# EAGLE design GPIO Split Protector (EAGLE 7.4.0)
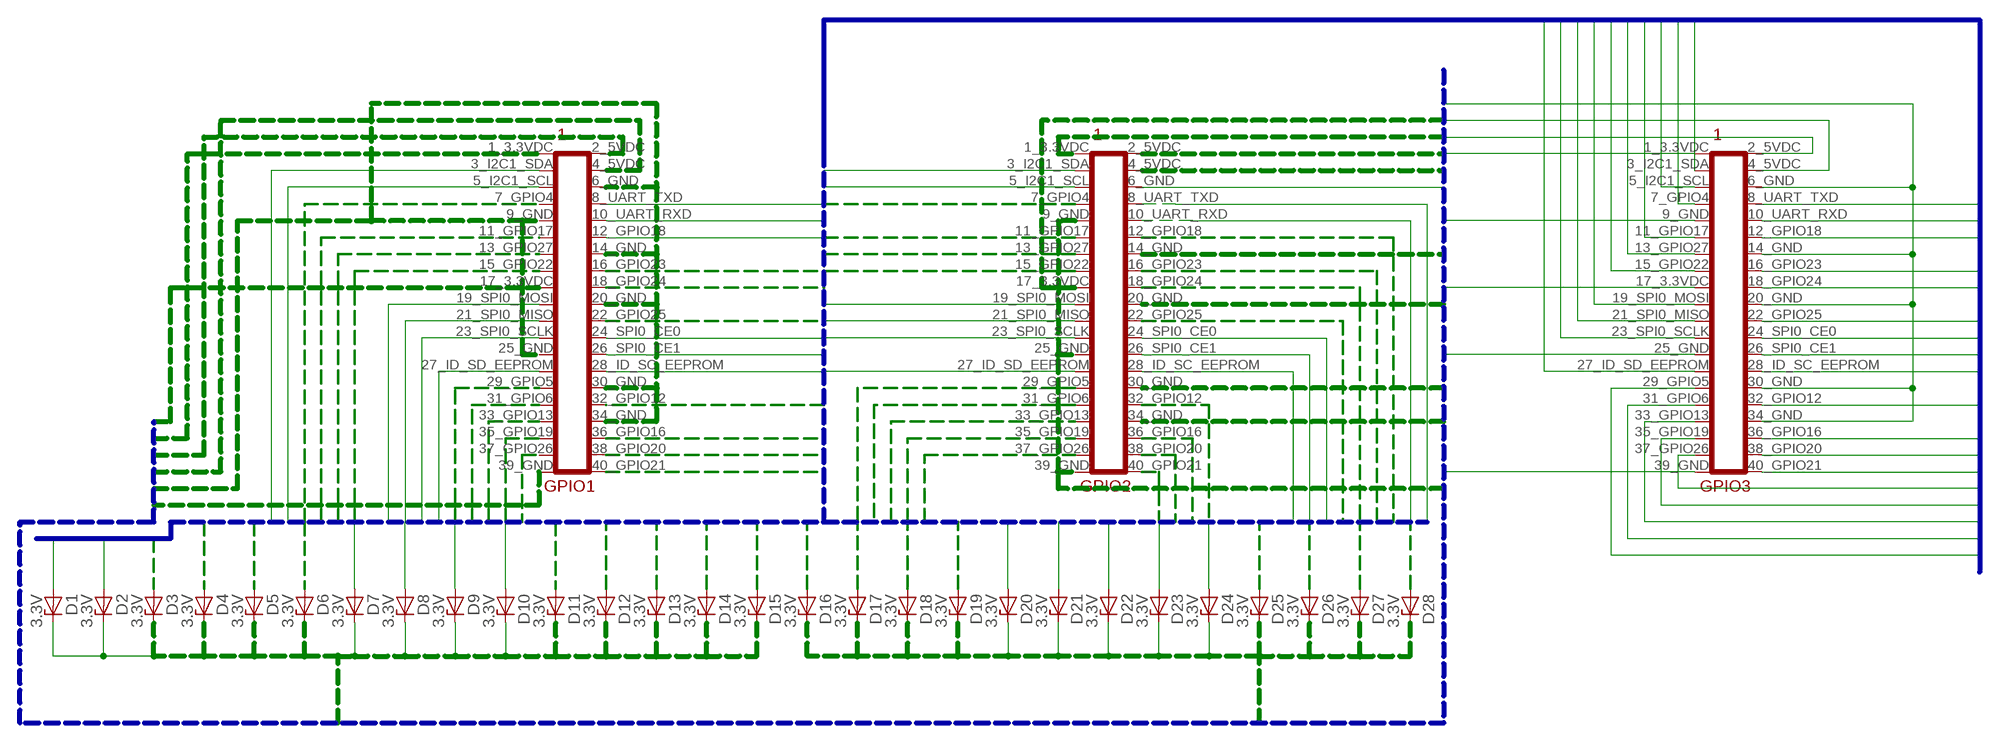
[diagram p0: schematic, sheet 1]

## Parts
D1  3.3V  ZENER-DIODEDO41Z10  [DO41Z10]
D2  3.3V  ZENER-DIODEDO41Z10  [DO41Z10]
D3  3.3V  ZENER-DIODEDO41Z10  [DO41Z10]
D4  3.3V  ZENER-DIODEDO41Z10  [DO41Z10]
D5  3.3V  ZENER-DIODEDO41Z10  [DO41Z10]
D6  3.3V  ZENER-DIODEDO41Z10  [DO41Z10]
D7  3.3V  ZENER-DIODEDO41Z10  [DO41Z10]
D8  3.3V  ZENER-DIODEDO41Z10  [DO41Z10]
D9  3.3V  ZENER-DIODEDO41Z10  [DO41Z10]
D10  3.3V  ZENER-DIODEDO41Z10  [DO41Z10]
D11  3.3V  ZENER-DIODEDO41Z10  [DO41Z10]
D12  3.3V  ZENER-DIODEDO41Z10  [DO41Z10]
D13  3.3V  ZENER-DIODEDO41Z10  [DO41Z10]
D14  3.3V  ZENER-DIODEDO41Z10  [DO41Z10]
D15  3.3V  ZENER-DIODEDO41Z10  [DO41Z10]
D16  3.3V  ZENER-DIODEDO41Z10  [DO41Z10]
D17  3.3V  ZENER-DIODEDO41Z10  [DO41Z10]
D18  3.3V  ZENER-DIODEDO41Z10  [DO41Z10]
D19  3.3V  ZENER-DIODEDO41Z10  [DO41Z10]
D20  3.3V  ZENER-DIODEDO41Z10  [DO41Z10]
D21  3.3V  ZENER-DIODEDO41Z10  [DO41Z10]
D22  3.3V  ZENER-DIODEDO41Z10  [DO41Z10]
D23  3.3V  ZENER-DIODEDO41Z10  [DO41Z10]
D24  3.3V  ZENER-DIODEDO41Z10  [DO41Z10]
D25  3.3V  ZENER-DIODEDO41Z10  [DO41Z10]
D26  3.3V  ZENER-DIODEDO41Z10  [DO41Z10]
D27  3.3V  ZENER-DIODEDO41Z10  [DO41Z10]
D28  3.3V  ZENER-DIODEDO41Z10  [DO41Z10]
GPIO1  RPI_GPIOUPPER  [RPI_GPIO_MALE]
GPIO2  RPI_GPIOUPPER  [RPI_GPIO_MALE]
GPIO3  RPI_GPIOUPPER  [RPI_GPIO_MALE]

## Nets
3.3VDC1: GPIO1.1_3.3VDC GPIO2.1_3.3VDC GPIO3.1_3.3VDC
3.3VDC2: GPIO1.17_3.3VDC GPIO2.17_3.3VDC GPIO3.17_3.3VDC
5VDC1: GPIO1.2_5VDC GPIO2.2_5VDC GPIO3.2_5VDC
5VDC2: GPIO1.4_5VDC GPIO2.4_5VDC GPIO3.4_5VDC
GND: D1.C D2.C D3.C D4.C D5.C D6.C D7.C D8.C D9.C D10.C D11.C D12.C D13.C D14.C D15.C D16.C D17.C D18.C D19.C D20.C D21.C D22.C D23.C D24.C D25.C D26.C D27.C D28.C GPIO1.6_GND GPIO1.9_GND GPIO1.14_GND GPIO1.20_GND GPIO1.25_GND GPIO1.30_GND GPIO1.34_GND GPIO1.39_GND GPIO2.6_GND GPIO2.9_GND GPIO2.14_GND GPIO2.20_GND GPIO2.25_GND GPIO2.30_GND GPIO2.34_GND GPIO2.39_GND GPIO3.6_GND GPIO3.9_GND GPIO3.14_GND GPIO3.20_GND GPIO3.25_GND GPIO3.30_GND GPIO3.34_GND GPIO3.39_GND
GPIO4: D3.A GPIO1.7_GPIO4 GPIO2.7_GPIO4 GPIO3.7_GPIO4
GPIO5: D11.A GPIO1.29_GPIO5 GPIO2.29_GPIO5 GPIO3.29_GPIO5
GPIO6: D12.A GPIO1.31_GPIO6 GPIO2.31_GPIO6 GPIO3.31_GPIO6
GPIO12: D25.A GPIO1.32_GPIO12 GPIO2.32_GPIO12 GPIO3.32_GPIO12
GPIO13: D13.A GPIO1.33_GPIO13 GPIO2.33_GPIO13 GPIO3.33_GPIO13
GPIO16: D26.A GPIO1.36_GPIO16 GPIO2.36_GPIO16 GPIO3.36_GPIO16
GPIO17: D4.A GPIO1.11_GPIO17 GPIO2.11_GPIO17 GPIO3.11_GPIO17
GPIO18: D16.A GPIO1.12_GPIO18 GPIO2.12_GPIO18 GPIO3.12_GPIO18
GPIO19: D14.A GPIO1.35_GPIO19 GPIO2.35_GPIO19 GPIO3.35_GPIO19
GPIO20: D27.A GPIO1.38_GPIO20 GPIO2.38_GPIO20 GPIO3.38_GPIO20
GPIO21: D28.A GPIO1.40_GPIO21 GPIO2.40_GPIO21 GPIO3.40_GPIO21
GPIO22: D6.A GPIO1.15_GPIO22 GPIO2.15_GPIO22 GPIO3.15_GPIO22
GPIO23: D17.A GPIO1.16_GPIO23 GPIO2.16_GPIO23 GPIO3.16_GPIO23
GPIO24: D18.A GPIO1.18_GPIO24 GPIO2.18_GPIO24 GPIO3.18_GPIO24
GPIO25: D19.A GPIO1.22_GPIO25 GPIO2.22_GPIO25 GPIO3.22_GPIO25
GPIO26: D15.A GPIO1.37_GPIO26 GPIO2.37_GPIO26 GPIO3.37_GPIO26
GPIO27: D5.A GPIO1.13_GPIO27 GPIO2.13_GPIO27 GPIO3.13_GPIO27
I2C_SCL: D2.A GPIO1.5_I2C1_SCL GPIO2.5_I2C1_SCL GPIO3.5_I2C1_SCL
I2C_SDA: D1.A GPIO1.3_I2C1_SDA GPIO2.3_I2C1_SDA GPIO3.3_I2C1_SDA
ID_SC: D24.A GPIO1.28_ID_SC_EEPROM GPIO2.28_ID_SC_EEPROM GPIO3.28_ID_SC_EEPROM
ID_SD: D10.A GPIO1.27_ID_SD_EEPROM(27_ID_SC_EEPROM) GPIO2.27_ID_SD_EEPROM(27_ID_SC_EEPROM) GPIO3.27_ID_SD_EEPROM(27_ID_SC_EEPROM)
SPI_CE0: D22.A GPIO1.24_SPI0_CE0 GPIO2.24_SPI0_CE0 GPIO3.24_SPI0_CE0
SPI_CE1: D23.A GPIO1.26_SPI0_CE1 GPIO2.26_SPI0_CE1 GPIO3.26_SPI0_CE1
SPI_MISO: D8.A GPIO1.21_SPI0_MISO GPIO2.21_SPI0_MISO GPIO3.21_SPI0_MISO
SPI_MOSI: D7.A GPIO1.19_SPI0_MOSI GPIO2.19_SPI0_MOSI GPIO3.19_SPI0_MOSI
SPI_SCLK: D9.A GPIO1.23_SPI0_SCLK GPIO2.23_SPI0_SCLK GPIO3.23_SPI0_SCLK
UART_RXD: D21.A GPIO1.10_UART_RXD(10_UART0_RXD) GPIO2.10_UART_RXD(10_UART0_RXD) GPIO3.10_UART_RXD(10_UART0_RXD)
UART_TXD: D20.A GPIO1.8_UART_TXD(8_UART0_TXD) GPIO2.8_UART_TXD(8_UART0_TXD) GPIO3.8_UART_TXD(8_UART0_TXD)

## Buses
3.3VDC1,3.3VDC2,5VDC1,5VDC2,GND
GPIO4,GPIO5,GPIO6,GPIO12,GPIO13,GPIO14,GPIO16,GPIO17,GPIO18,GPIO19,GPIO20,GPIO21,GPIO22,GPIO23,GPIO24,GPIO25,GPIO26,GPIO27,ID_SC,ID_SD,I2C_SCL,I2C_SDA,SPI_CE0,SPI_CE1,SPI_MISO,SPI_MOSI,SPI_SCLK,UART_RXD,UART_TXD

## Library data of the parts
D1-D28 = diode:ZENER-DIODE: Z-Diode
GPIO1-GPIO3 = connectors:RPI_GPIO*: GPIO Connector for Raspberry Pi.

## Board
GPIO Protect & Split Splits the GPIO connection into two connectors, while adding protection to IO circuits so they can only take 3.3VDC and no more. All extra power gets grounded. Mounting The assembly is made to mount underneat the RPi, with the single GPIO connector hanging out. Tall enough standoffs should be used to allow connection to both connectors underneath it.
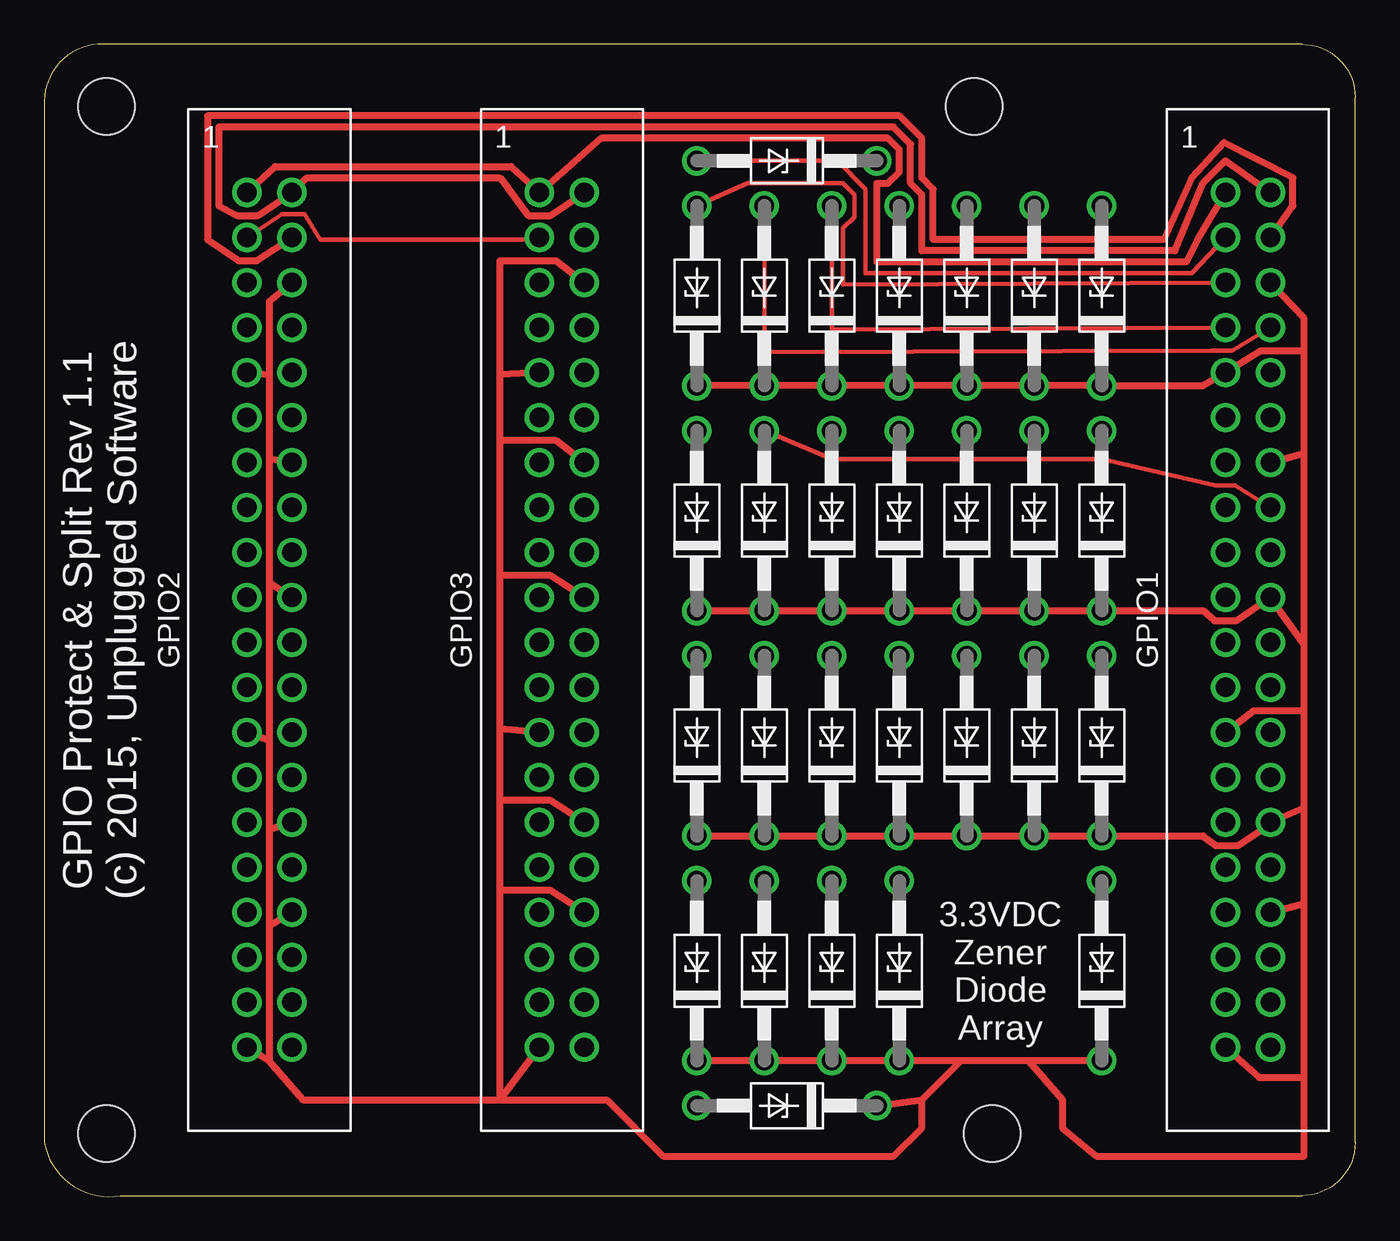
[diagram p1: board, top side]
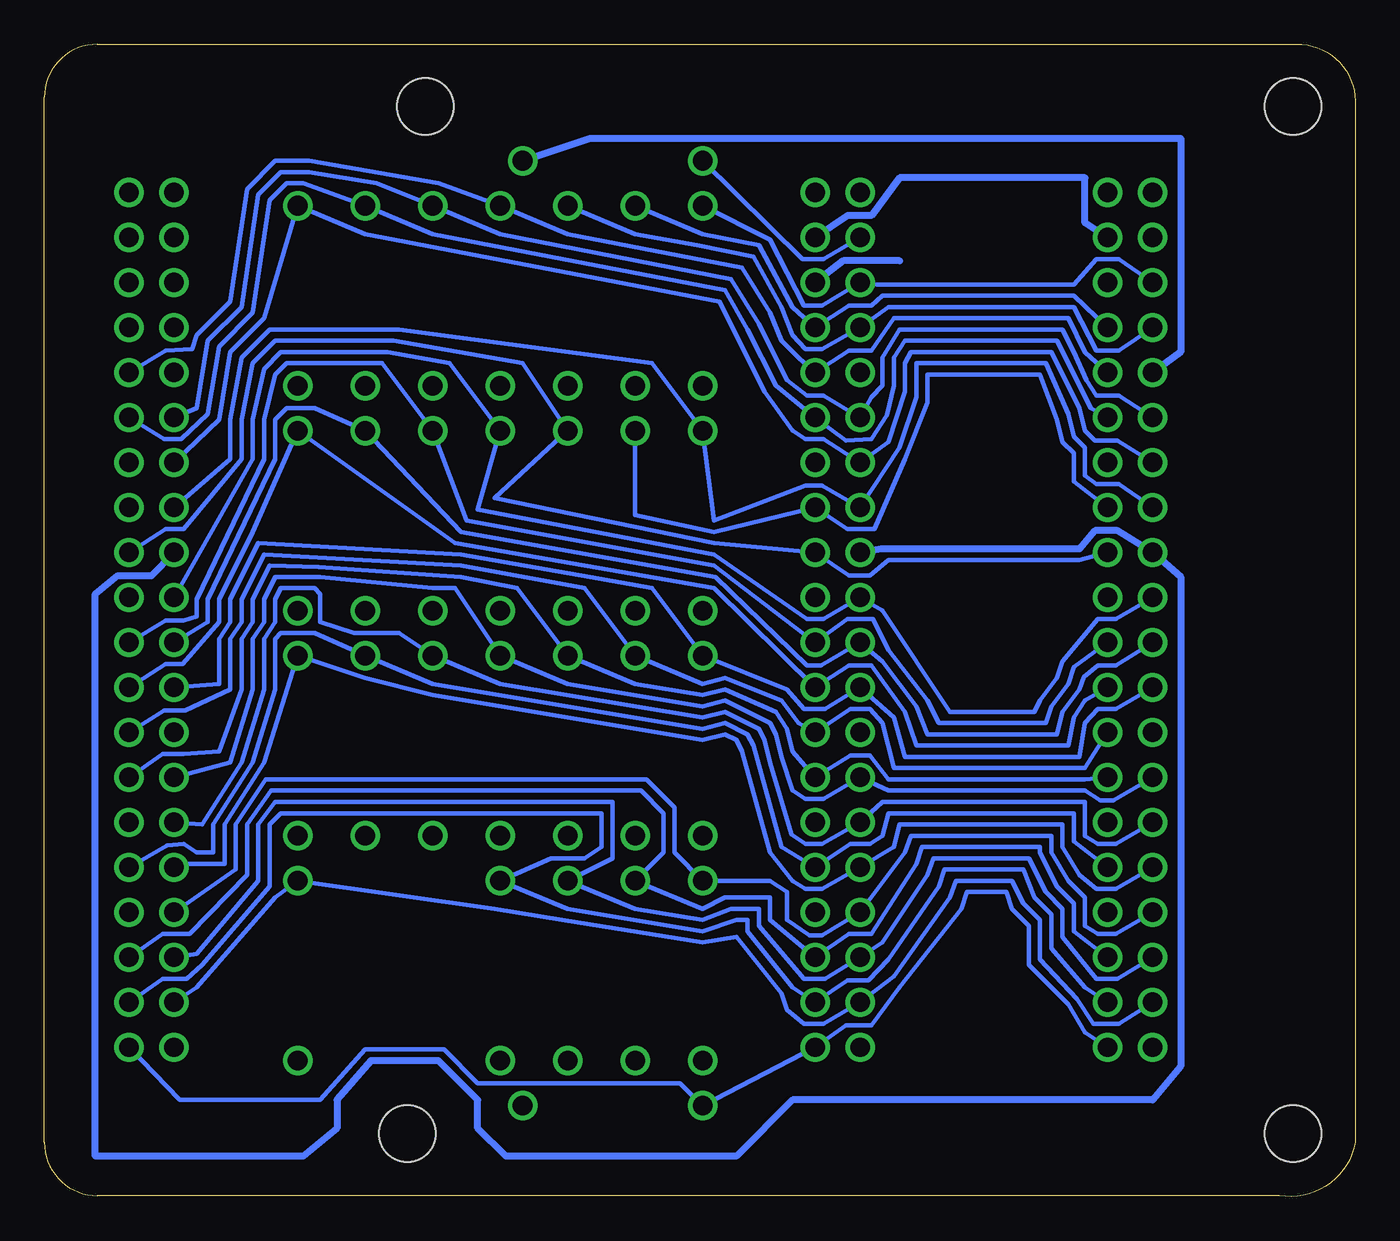
[diagram p2: board, bottom side, seen from below]

Size 74.01 x 65.05 mm. Coordinates in mm from the lower left corner, seen from the top.
Outline: 4.28,0.05 71.01,0.05 arc90 74.01,3.05 74.01,62.05 arc90 71.01,65.05 3.01,65.05 arc90 0.01,61.55 0.01,3.05 arc90 4.28,0.05
Copper layers (1*16): Top 0.035mm / dielectric 1.5mm / Bottom 0.035mm
Design rules "default *": minimum track width 10mil, minimum drill 24mil, track to track 8mil, track to pad 8mil, pad to pad 8mil, via to via 8mil, smd to smd 8mil, copper to edge 40mil, drill to drill 8mil, minimum pad ring 10mil, minimum via ring 8mil, stop-mask expansion 4mil, vias tented up to drill 0mil, thermal gap 10mil
Holes 3.2 mm at 3.51,3.55 53.51,3.55 52.51,61.55 3.51,61.55

### Footprints (pad centres in the part's own frame; a part is rotated, then mirrored left to right if it is on the bottom)
DO41Z10 = drill 1.118: A 5.08,0; C -5.08,0
RPI_GPIO_MALE = drill 1.1: 1_3.3VDC -1.27,24.13; 2_5VDC 1.27,24.13; 3_I2C1_SDA -1.27,21.59; 4_5VDC 1.27,21.59; 5_I2C1_SCL -1.27,19.05; 6_GND 1.27,19.05; 7_GPIO4 -1.27,16.51; 8_UART_TXD 1.27,16.51; 9_GND -1.27,13.97; 10_UART_RXD 1.27,13.97; 11_GPIO17 -1.27,11.43; 12_GPIO18 1.27,11.43; 13_GPIO27 -1.27,8.89; 14_GND 1.27,8.89; 15_GPIO22 -1.27,6.35; 16_GPIO23 1.27,6.35; 17_3.3VDC -1.27,3.81; 18_GPIO24 1.27,3.81; 19_SPI0_MOSI -1.27,1.27; 20_GND 1.27,1.27; 21_SPI0_MISO -1.27,-1.27; 22_GPIO25 1.27,-1.27; 23_SPI0_SCLK -1.27,-3.81; 24_SPI0_CE0 1.27,-3.81; 25_GND -1.27,-6.35; 26_SPI0_CE1 1.27,-6.35; 27_ID_SD_EEPROM -1.27,-8.89; 28_ID_SC_EEPROM 1.27,-8.89; 29_GPIO5 -1.27,-11.43; 30_GND 1.27,-11.43; 31_GPIO6 -1.27,-13.97; 32_GPIO12 1.27,-13.97; 33_GPIO13 -1.27,-16.51; 34_GND 1.27,-16.51; 35_GPIO19 -1.27,-19.05; 36_GPIO16 1.27,-19.05; 37_GPIO26 -1.27,-21.59; 38_GPIO20 1.27,-21.59; 39_GND -1.27,-24.13; 40_GPIO21 1.27,-24.13

### Placement (x,y rotation side)
D1  41.92,58.47 180 top
D2  36.84,50.85 90 top
D3  44.46,50.85 90 top
D4  52.08,50.85 90 top
D5  59.7,50.85 90 top
D6  36.84,38.15 90 top
D7  48.27,38.15 90 top
D8  55.89,38.15 90 top
D9  36.84,25.45 90 top
D10  48.27,25.45 90 top
D11  52.08,25.45 90 top
D12  59.7,25.45 90 top
D13  36.84,12.75 90 top
D14  44.46,12.75 90 top
D15  59.7,12.75 90 top
D16  55.89,50.85 90 top
D17  40.65,38.15 90 top
D18  44.46,38.15 90 top
D19  52.08,38.15 90 top
D20  40.65,50.85 90 top
D21  48.27,50.85 90 top
D22  59.7,38.15 90 top
D23  40.65,25.45 90 top
D24  44.46,25.45 90 top
D25  55.89,25.45 90 top
D26  40.65,12.75 90 top
D27  48.27,12.75 90 top
D28  41.92,5.13 180 top
GPIO1  67.95,32.55 0 top
GPIO2  12.71,32.55 0 top
GPIO3  29.22,32.55 0 top

### Tracks (layer width: path | path; a pad name or v marks a point on that pad's centre or on a via)
3.3VDC1
  Top 0.406: GPIO2.1_3.3VDC 13.03,58.16 26.36,58.16 GPIO3.1_3.3VDC 31.44,59.74 47.63,59.74 48.27,59.11 48.27,57.84 47.63,57.2 47,57.2 47,52.76 64.46,52.76 65.1,54.03 GPIO1.1_3.3VDC
3.3VDC2
  Bottom 0.406: GPIO3.17_3.3VDC 26.76,36.57 15.57,36.57 14.69,37.6 13.42,37.6 GPIO2.17_3.3VDC 9.85,34.98 9.85,7.36 11.44,5.45 31.76,5.45 34.93,2.28 47.95,2.28 49.54,3.86 49.54,5.45 51.76,7.67 55.57,7.67 57.48,5.45 57.48,3.86 59.38,2.28 71.13,2.28 71.13,34.03 69.86,35.06 67.95,35.06 GPIO1.17_3.3VDC
5VDC1
  Top 0.406: GPIO3.2_5VDC 28.58,55.38 27.31,55.38 25.73,57.52 14.82,57.52 GPIO2.2_5VDC 12.07,55.38 10.88,55.38 9.85,55.93 9.85,60.38 47.95,60.38 48.9,59.43 48.9,57.2 49.54,56.57 49.54,53.39 63.83,53.39 65.41,57.2 66.68,58.47 GPIO1.2_5VDC
5VDC2
  Top 0.406: GPIO1.4_5VDC 70.49,55.93 70.49,57.52 66.61,59.51 64.78,57.52 63.19,54.03 50.17,54.03 50.17,56.89 49.54,57.52 49.54,59.74 48.27,61.01 9.22,61.01 9.22,54.03 10.96,52.84 12,52.84 GPIO2.4_5VDC
  Bottom 0.406: GPIO2.4_5VDC 15.25,54.98 15.25,57.52 25.73,57.52 27.31,55.38 28.66,55.38 GPIO3.4_5VDC
GND
  Top 0.406: GPIO2.6_GND 12.71,50.54 12.71,46.41 | 12.71,46.41 12.71,41.65 | 12.71,41.65 12.71,34.66 | 12.71,34.66 12.71,25.77 | 12.71,25.77 12.71,20.69 | 12.71,20.69 12.71,15.29 | 12.71,15.29 12.71,7.67 | 12.71,7.67 14.61,5.45 25.73,5.45 | 25.73,5.45 GPIO3.39_GND | 25.73,5.45 25.73,17.28 | 25.73,17.28 25.73,22.36 | 25.73,22.36 25.73,26.41 | 25.73,26.41 25.73,35.06 | 25.73,35.06 25.73,42.68 | 25.73,42.68 25.73,46.41 | 25.73,46.41 25.73,52.84 28.9,52.84 GPIO3.6_GND | 25.73,5.45 31.76,5.45 34.93,2.28 47.95,2.28 49.54,3.86 49.54,5.45 | 71.13,6.72 71.13,2.28 59.38,2.28 57.48,3.86 57.48,5.45 55.57,7.67 | 71.13,6.72 71.13,16.56 | 71.13,16.56 71.13,21.96 | 71.13,21.96 71.13,27.44 | 71.13,27.44 71.13,31.17 | 71.13,31.17 71.13,41.96 | 71.13,41.96 71.13,47.76 | 71.13,47.76 71.13,49.58 GPIO1.6_GND | 71.13,47.76 68.67,47.76 GPIO1.9_GND 65.41,45.77 D5.C D16.C D4.C D21.C D3.C D20.C D2.C | 71.13,31.17 GPIO1.20_GND 67.32,32.52 66.05,32.52 65.41,33.07 D22.C D8.C D19.C D7.C D18.C D17.C D6.C | GPIO1.25_GND 68.27,27.44 71.13,27.44 | GPIO1.30_GND 69.71,21.34 | 69.71,21.34 71.13,21.96 | GPIO1.34_GND 71.13,16.56 | GPIO1.39_GND 68.59,6.72 71.13,6.72 | GPIO1.14_GND 71.13,41.96 | 12.71,7.67 GPIO2.39_GND | 12.71,15.29 GPIO2.34_GND | GPIO2.30_GND 12.71,20.69 | GPIO2.25_GND 12.71,25.77 | GPIO2.20_GND 12.71,34.66 | GPIO2.14_GND 12.71,41.65 | GPIO2.9_GND 12.71,46.41 | GPIO3.9_GND 25.73,46.41 | GPIO3.14_GND 28.9,42.68 25.73,42.68 | GPIO3.20_GND 28.58,35.06 25.73,35.06 | GPIO3.25_GND 25.73,26.41 | GPIO3.30_GND 28.58,22.36 25.73,22.36 | GPIO3.34_GND 28.58,17.28 25.73,17.28 | 69.71,21.34 67.4,19.82 66.13,19.82 65.41,20.37 D12.C D25.C D11.C D10.C D24.C D23.C D9.C
  Top 0.406: D15.C 55.57,7.67 | 55.57,7.67 51.76,7.67 | 51.76,7.67 D27.C D14.C D26.C D13.C | 49.54,5.45 51.76,7.67 | D28.C 49.54,5.45
  Bottom 0.406: D1.C 43.19,59.74 9.85,59.74 9.85,47.68 GPIO2.9_GND | 25.73,52.84 28.9,52.84 GPIO3.6_GND
GPIO4
  Top 0.254: GPIO1.7_GPIO4 44.46,48.95 D3.A
  Bottom 0.254: GPIO2.7_GPIO4 13.34,47.76 14.61,47.76 15.88,50.22 26.36,50.22 GPIO3.7_GPIO4 30.09,47.84 31.05,47.84 31.76,48.63 32.39,50.22 33.98,53.08 37.16,53.71 40.65,54.35 D3.A
GPIO5
  Bottom 0.254: GPIO2.29_GPIO5 13.5,19.9 14.54,19.9 15.25,20.37 15.25,22.28 26.68,22.28 GPIO3.29_GPIO5 30.09,19.9 31.05,19.9 31.84,20.45 33.03,24.5 33.35,25.77 33.66,26.41 35.57,27.36 36.84,27.04 48.27,28.95 D11.A 53.98,31.8 56.52,31.8 58.43,32.44 58.43,34.03 58.75,34.34 60.65,34.34 60.97,33.71 60.97,32.44 61.6,31.49 61.6,28.63 62.87,24.5 65.1,21.01 GPIO1.29_GPIO5
GPIO6
  Bottom 0.254: GPIO2.31_GPIO6 13.5,17.36 14.61,17.36 15.57,18.15 16.52,19.74 16.52,21.01 25.73,21.01 26.04,19.74 GPIO3.31_GPIO6 30.09,17.36 31.05,17.36 31.76,17.83 33.03,19.42 34.62,25.14 34.93,25.77 35.57,26.09 36.84,25.77 52.08,28.31 55.89,29.26 D12.A 61.6,24.5 63.83,21.01 63.83,18.79 66.48,18.79 GPIO1.31_GPIO6
GPIO12
  Bottom 0.254: GPIO2.32_GPIO12 15.88,20.06 15.88,21.64 26.36,21.64 26.68,20.37 27.39,19.9 28.51,19.9 GPIO3.32_GPIO12 32.39,19.74 33.98,25.45 34.3,26.09 35.57,26.72 36.84,26.41 52.08,28.95 D25.A 58.75,31.8 60.65,31.8 60.97,31.49 60.97,28.63 62.24,24.5 64.46,21.01 64.46,19.42 65.41,19.42 66.13,19.9 67.08,19.82 GPIO1.32_GPIO12
GPIO13
  Bottom 0.254: GPIO2.33_GPIO13 13.5,14.82 14.54,14.82 15.25,15.29 15.25,16.88 16.2,17.83 17.15,19.42 17.15,20.37 25.09,20.37 25.41,19.42 GPIO3.33_GPIO13 30.09,14.74 30.81,14.74 32.08,15.61 32.08,17.2 33.03,17.83 D13.A 38.43,19.42 38.43,21.96 40.01,23.55 61.53,23.55 63.19,21.01 63.19,18.47 GPIO1.33_GPIO13
GPIO16
  Bottom 0.254: GPIO2.36_GPIO16 15.88,14.98 15.88,16.56 16.84,17.52 17.79,19.42 17.79,19.74 24.46,19.74 24.77,18.79 27.31,14.82 28.58,14.82 GPIO3.36_GPIO16 33.03,15.61 33.03,16.88 35.57,16.88 36.84,16.25 D26.A 39.06,19.42 39.06,21.64 40.33,22.91 61.21,22.91 62.56,21.01 62.56,18.15 65.81,14.82 67.32,14.82 GPIO1.36_GPIO16
GPIO17
  Bottom 0.254: GPIO2.11_GPIO17 13.34,45.22 14.61,45.22 15.17,46.09 15.88,47.68 16.52,48.95 25.73,48.95 26.68,47.36 26.68,45.77 27.31,45.14 GPIO3.11_GPIO17 30.01,45.22 30.97,45.22 32.08,46.09 33.66,49.27 35.25,51.81 48.27,54.35 D4.A 55.25,57.2 59.06,57.84 60.65,57.84 61.92,56.57 62.87,50.22 64.78,48.31 65.41,44.5 GPIO1.11_GPIO17
GPIO18
  Bottom 0.254: GPIO2.12_GPIO18 14.93,44.5 16.84,48.31 25.41,48.31 26.04,47.36 26.04,45.77 26.44,44.11 27.31,42.76 28.74,42.68 GPIO3.12_GPIO18 32.71,45.77 34.3,48.95 35.57,51.17 52.08,54.35 D16.A 59.38,57.2 60.33,57.2 61.29,56.25 62.24,49.9 64.14,48 64.78,44.19 66.29,42.76 67.24,42.76 GPIO1.12_GPIO18
GPIO19
  Bottom 0.254: GPIO2.35_GPIO19 13.42,12.28 14.61,12.28 16.52,14.66 16.52,16.25 17.47,17.2 18.42,19.1 23.82,19.1 24.14,18.15 26.68,14.34 GPIO3.35_GPIO19 29.93,12.28 31.12,12.28 33.66,15.29 33.66,16.25 35.25,16.25 36.84,15.61 40.65,16.25 D14.A 41.92,19.1 41.92,22.28 60.97,22.28 61.92,21.01 61.92,17.83 65.41,13.71 GPIO1.35_GPIO19
GPIO20
  Bottom 0.254: GPIO2.38_GPIO20 15.25,11.8 17.15,14.02 17.15,15.93 18.11,16.88 18.74,18.47 23.19,18.47 23.5,17.52 26.36,13.39 27.47,12.2 28.66,12.2 GPIO3.38_GPIO20 31.76,11.8 34.3,14.98 34.3,15.61 34.93,15.61 36.84,14.98 44.46,16.25 D27.A 45.41,19.1 43.51,19.1 42.55,19.74 42.55,21.64 60.65,21.64 61.29,21.01 61.29,17.52 65.1,13.07 65.97,12.28 67.32,12.28 GPIO1.38_GPIO20
GPIO21
  Bottom 0.254: GPIO2.40_GPIO21 15.25,9.26 16.2,10.85 18.42,13.07 18.42,15.29 19.38,16.25 19.69,17.2 21.92,17.2 22.23,16.25 25.73,11.8 27.31,9.66 28.74,9.66 GPIO3.40_GPIO21 D28.A 38.11,6.4 49.54,6.4 51.44,8.31 55.89,8.31 58.43,5.45 66.37,5.45 GPIO1.40_GPIO21
GPIO22
  Bottom 0.254: GPIO2.15_GPIO22 13.34,40.22 14.61,40.22 15.25,40.69 15.25,42.28 15.88,42.92 16.2,44.19 17.47,47.04 24.77,47.04 24.77,45.14 25.73,42.28 GPIO3.15_GPIO22 30.09,40.14 31.05,40.14 36.2,38.15 D6.A 39.7,47.04 53.98,48.95 61.29,48.95 62.87,47.36 63.51,43.87 63.51,41.65 GPIO1.15_GPIO22
GPIO23
  Top 0.254: GPIO1.16_GPIO23 67.24,40.14 66.13,40.14 59.7,41.65 44.46,41.65 D17.A
  Bottom 0.254: GPIO2.16_GPIO23 15.88,40.38 15.88,41.96 16.52,42.6 16.84,43.87 17.79,46.41 24.14,46.41 24.14,44.82 25.41,41.65 27.16,37.68 28.66,37.68 GPIO3.16_GPIO23 36.2,37.52 40.65,38.47 D17.A
GPIO24
  Bottom 0.254: GPIO2.18_GPIO24 15.57,35.93 26.36,35.93 27.39,35.06 28.58,35.06 GPIO3.18_GPIO24 36.2,36.88 48.59,39.42 D18.A 47,47.04 54.3,48.31 60.97,48.31 62.24,47.04 62.87,43.87 62.87,41.65 66.13,37.68 67.16,37.68 GPIO1.18_GPIO24
GPIO25
  Bottom 0.254: GPIO2.22_GPIO25 15.88,29.9 16.2,28.95 17.15,27.68 17.47,26.72 23.5,26.72 24.14,27.99 26.36,30.85 27.24,32.6 28.66,32.6 GPIO3.22_GPIO25 36.2,35.61 50.17,38.15 D19.A 54.94,47.04 60.33,47.04 60.97,46.41 61.6,43.87 61.6,41.65 65.41,33.71 65.41,32.76 66.13,32.52 67.16,32.52 GPIO1.22_GPIO25
GPIO26
  Bottom 0.254: GPIO2.37_GPIO26 13.34,9.74 14.77,9.74 15.73,11.17 17.79,13.39 17.79,15.61 18.74,16.56 19.38,17.83 22.55,17.83 22.87,16.88 26.04,12.44 GPIO3.37_GPIO26 30.01,9.74 31.12,9.74 32.08,10.53 32.39,11.48 34.93,14.66 36.84,14.34 44.78,15.61 48.59,16.25 D15.A 60.97,16.88 65.41,11.8 GPIO1.37_GPIO26
GPIO27
  Bottom 0.254: GPIO2.13_GPIO27 13.42,42.68 14.69,42.68 15.25,43.23 15.57,44.5 17.15,47.68 25.09,47.68 25.41,47.04 25.41,45.46 26.36,42.6 GPIO3.13_GPIO27 30.01,42.76 31.05,42.76 31.76,43.23 33.35,45.46 35.89,50.54 55.89,54.35 D5.A 61.6,49.58 63.51,47.68 64.14,43.87 GPIO1.13_GPIO27
I2C_SCL
  Top 0.254: GPIO1.5_I2C1_SCL 45.09,51.49 45.09,54.66 45.73,55.3 45.73,56.57 45.09,57.2 39.7,57.2 D2.A
  Bottom 0.254: GPIO2.5_I2C1_SCL 13.34,52.92 14.61,52.92 15.88,51.49 27,51.49 GPIO3.5_I2C1_SCL 30.09,50.3 31.12,50.3 33.03,54.03 D2.A
I2C_SDA
  Top 0.254: GPIO2.3_I2C1_SDA 13.42,55.46 14.69,55.46 15.57,54.03 27,54.03 GPIO3.3_I2C1_SDA | GPIO1.3_I2C1_SDA 64.78,52.12 46.36,52.12 46.36,56.89 44.78,58.47 D1.A
  Bottom 0.254: GPIO3.3_I2C1_SDA 30.01,52.92 31.2,52.92 D1.A
ID_SC
  Bottom 0.254: GPIO2.28_ID_SC_EEPROM 15.25,23.55 26.36,23.55 27.39,24.9 28.51,24.9 GPIO3.28_ID_SC_EEPROM 31.76,25.14 32.08,26.41 32.71,27.36 35.57,28.63 36.84,28.31 40.65,28.95 D24.A 47.32,34.34 50.49,34.98 58.51,35.54 61.29,35.61 62.24,33.71 62.24,32.44 62.87,31.49 62.87,28.63 64.14,25.14 66.13,24.98 67.32,24.98 GPIO1.28_ID_SC_EEPROM
ID_SD
  Bottom 0.254: GPIO2.27_ID_SD_EEPROM 13.66,22.36 14.38,22.36 15.25,22.91 26.36,22.91 GPIO3.27_ID_SD_EEPROM 30.01,22.44 31.05,22.44 31.76,22.91 32.39,24.82 32.71,26.09 33.03,26.72 35.57,27.99 36.84,27.68 44.46,28.95 D10.A 50.81,34.34 52.08,34.34 58.43,34.98 60.97,34.98 61.6,33.71 61.6,32.44 62.24,31.49 62.24,28.63 63.51,24.5 GPIO1.27_ID_SD_EEPROM
SPI_CE0
  Bottom 0.254: GPIO2.24_SPI0_CE0 15.25,27.99 15.88,27.04 16.2,25.45 24.77,25.45 25.41,27.36 27.31,29.98 28.58,29.98 GPIO3.24_SPI0_CE0 36.2,34.34 50.81,36.88 D22.A 62.24,37.52 64.14,33.71 64.14,32.44 66.21,30.06 67.16,30.06 GPIO1.24_SPI0_CE0
SPI_CE1
  Bottom 0.254: GPIO2.26_SPI0_CE1 15.25,24.18 26.04,24.18 26.68,26.72 27.39,27.52 28.51,27.52 GPIO3.26_SPI0_CE1 31.44,26.72 32.39,27.99 35.57,29.26 36.84,28.95 D23.A 43.51,34.34 50.49,35.61 61.6,36.25 62.87,33.71 62.87,32.44 63.51,31.49 63.51,28.63 66.05,27.44 67.24,27.44 GPIO1.26_SPI0_CE1
SPI_MISO
  Bottom 0.254: GPIO2.21_SPI0_MISO 13.5,29.98 14.54,29.98 15.33,29.34 15.57,28.63 16.52,27.36 16.84,26.09 24.14,26.09 24.77,27.68 26.68,30.22 GPIO3.21_SPI0_MISO 30.17,29.98 30.97,29.98 36.13,34.98 50.49,37.52 D8.A 58.75,44.5 60.33,44.5 60.97,43.87 60.97,41.65 64.78,33.71 64.78,32.44 GPIO1.21_SPI0_MISO
SPI_MOSI
  Bottom 0.254: GPIO2.19_SPI0_MOSI 13.5,32.6 14.54,32.6 16.52,30.22 16.84,29.26 17.79,27.99 18.11,27.36 22.87,27.36 26.68,33.07 GPIO3.19_SPI0_MOSI 30.01,32.6 30.97,32.6 36.2,36.25 49.54,38.79 D7.A 51.13,47.04 54.62,47.68 60.65,47.68 61.6,46.73 62.24,43.87 62.24,41.65 GPIO1.19_SPI0_MOSI
SPI_SCLK
  Bottom 0.254: GPIO2.23_SPI0_SCLK 13.5,27.52 14.54,27.52 15.25,26.72 15.57,24.82 25.41,24.82 26.04,27.04 GPIO3.23_SPI0_SCLK 29.93,27.52 31.12,27.52 32.08,28.63 D9.A 39.7,34.34 43.19,34.98 50.49,36.25 61.92,36.88 63.51,33.71 63.51,32.44 64.14,31.49 64.14,28.95 GPIO1.23_SPI0_SCLK
UART_RXD
  Bottom 0.254: GPIO2.10_UART_RXD 15.25,47.68 16.2,49.58 26.04,49.58 27.31,47.76 28.58,47.76 GPIO3.10_UART_RXD 31.44,47.36 32.39,48.31 33.03,49.9 34.62,52.44 44.46,54.35 D21.A 51.76,57.2 59.06,58.47 60.97,58.47 62.56,56.89 63.51,50.54 65.41,48.63 65.65,47.84 67.16,47.76 GPIO1.10_UART_RXD
UART_TXD
  Top 0.254: GPIO1.8_UART_TXD 67.08,47.76 65.89,47.76 40.65,47.68 D20.A
  Bottom 0.254: GPIO2.8_UART_TXD 15.88,50.85 26.68,50.85 27.31,50.3 28.58,50.3 GPIO3.8_UART_TXD 31.76,50.22 33.66,53.71 36.84,54.35 D20.A

### Text on the board
tNames: GPIO Protect & Split Rev 1.1 / (c) 2015, Unplugged Software | 3.3VDC / Zener / Diode / Array